# Altium schematic sheet DartBoard.SchDoc
size A1
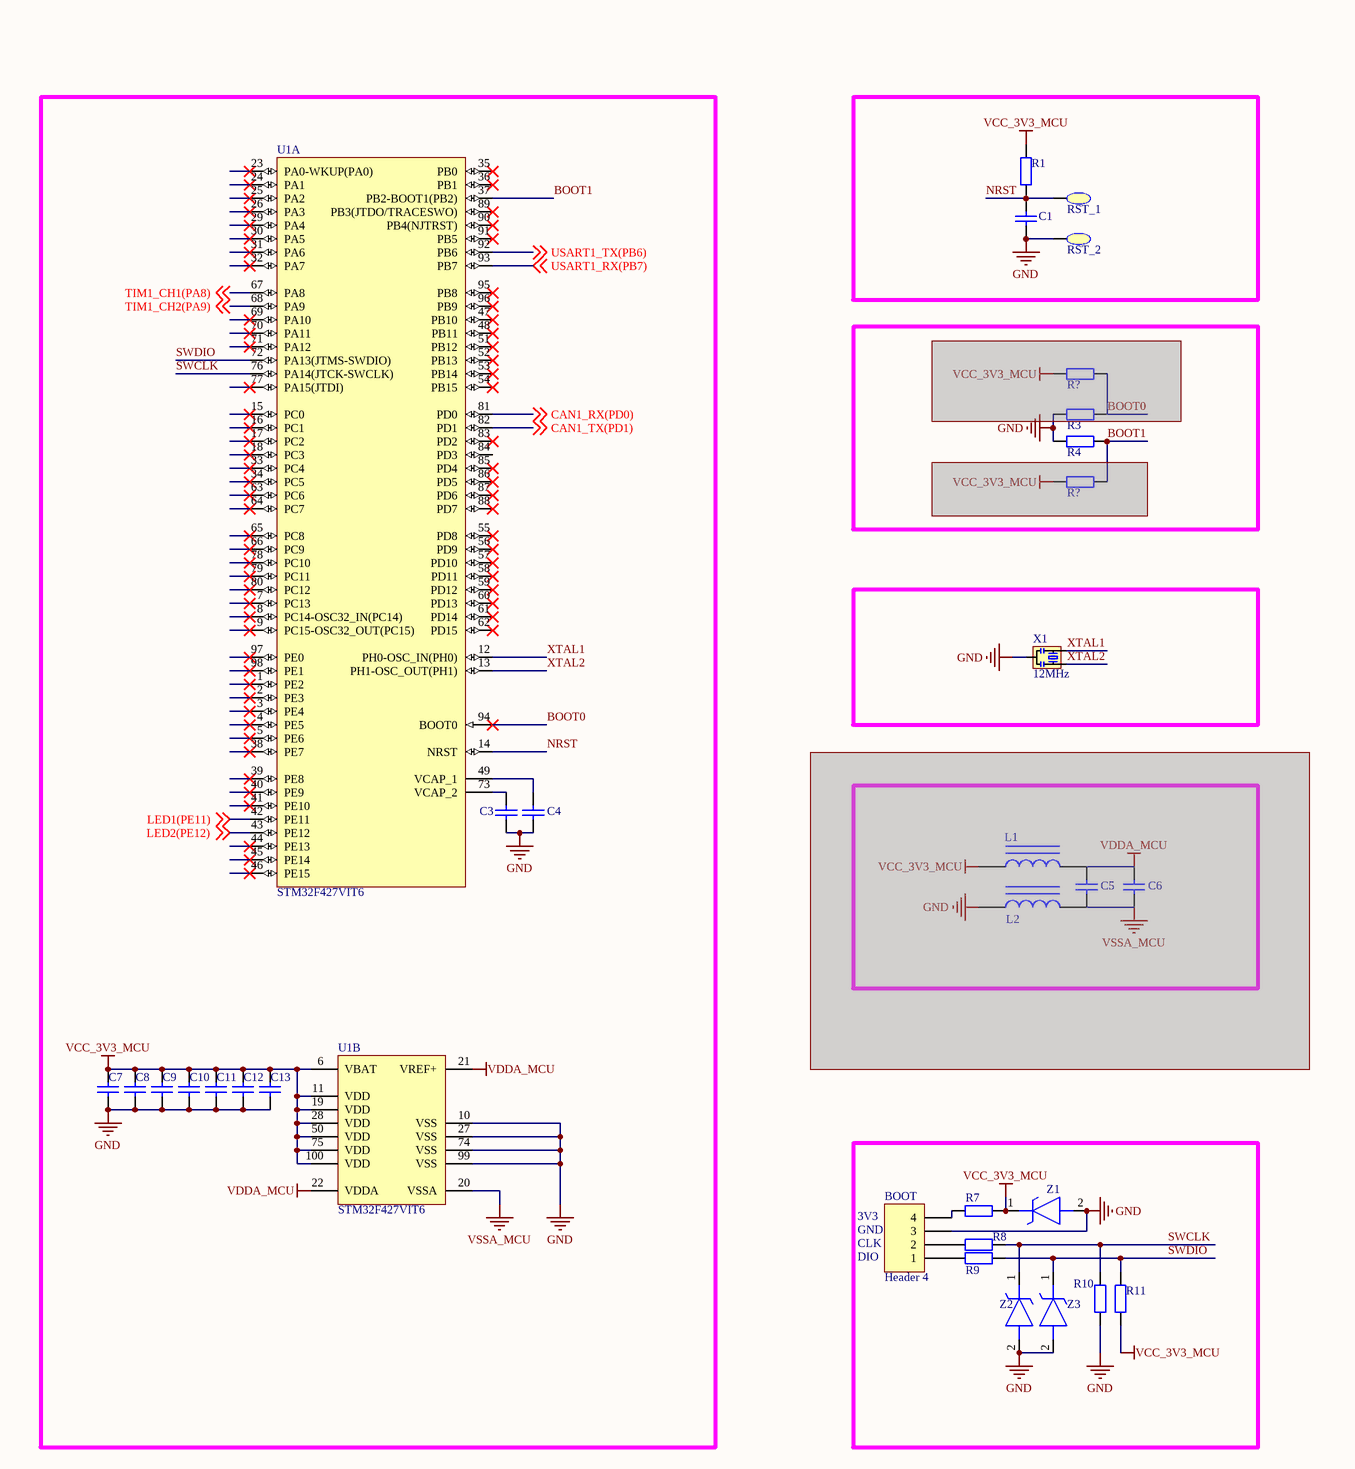
[diagram p0: DartBoard.SchDoc, top left]
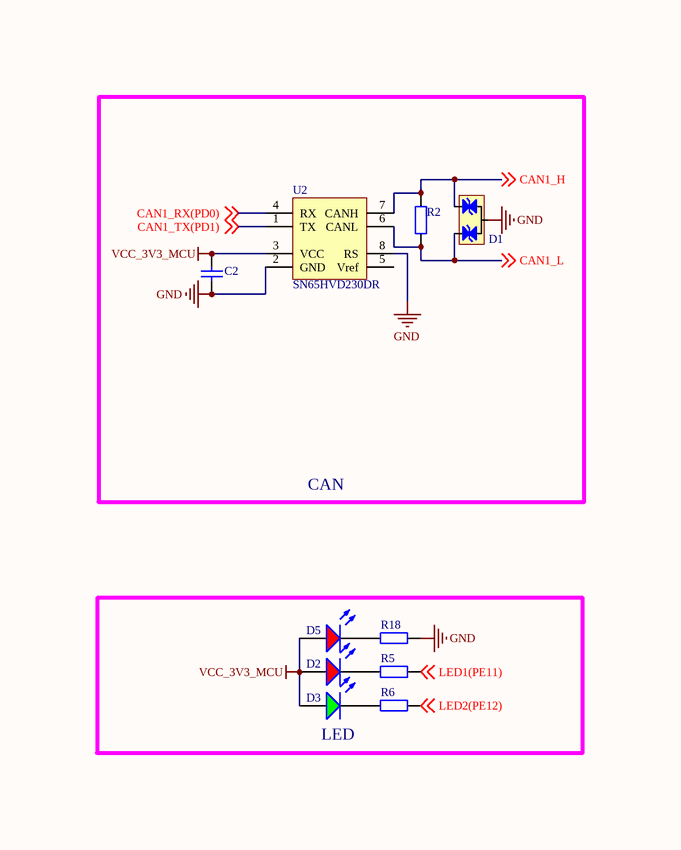
[diagram p1: DartBoard.SchDoc, top middle]
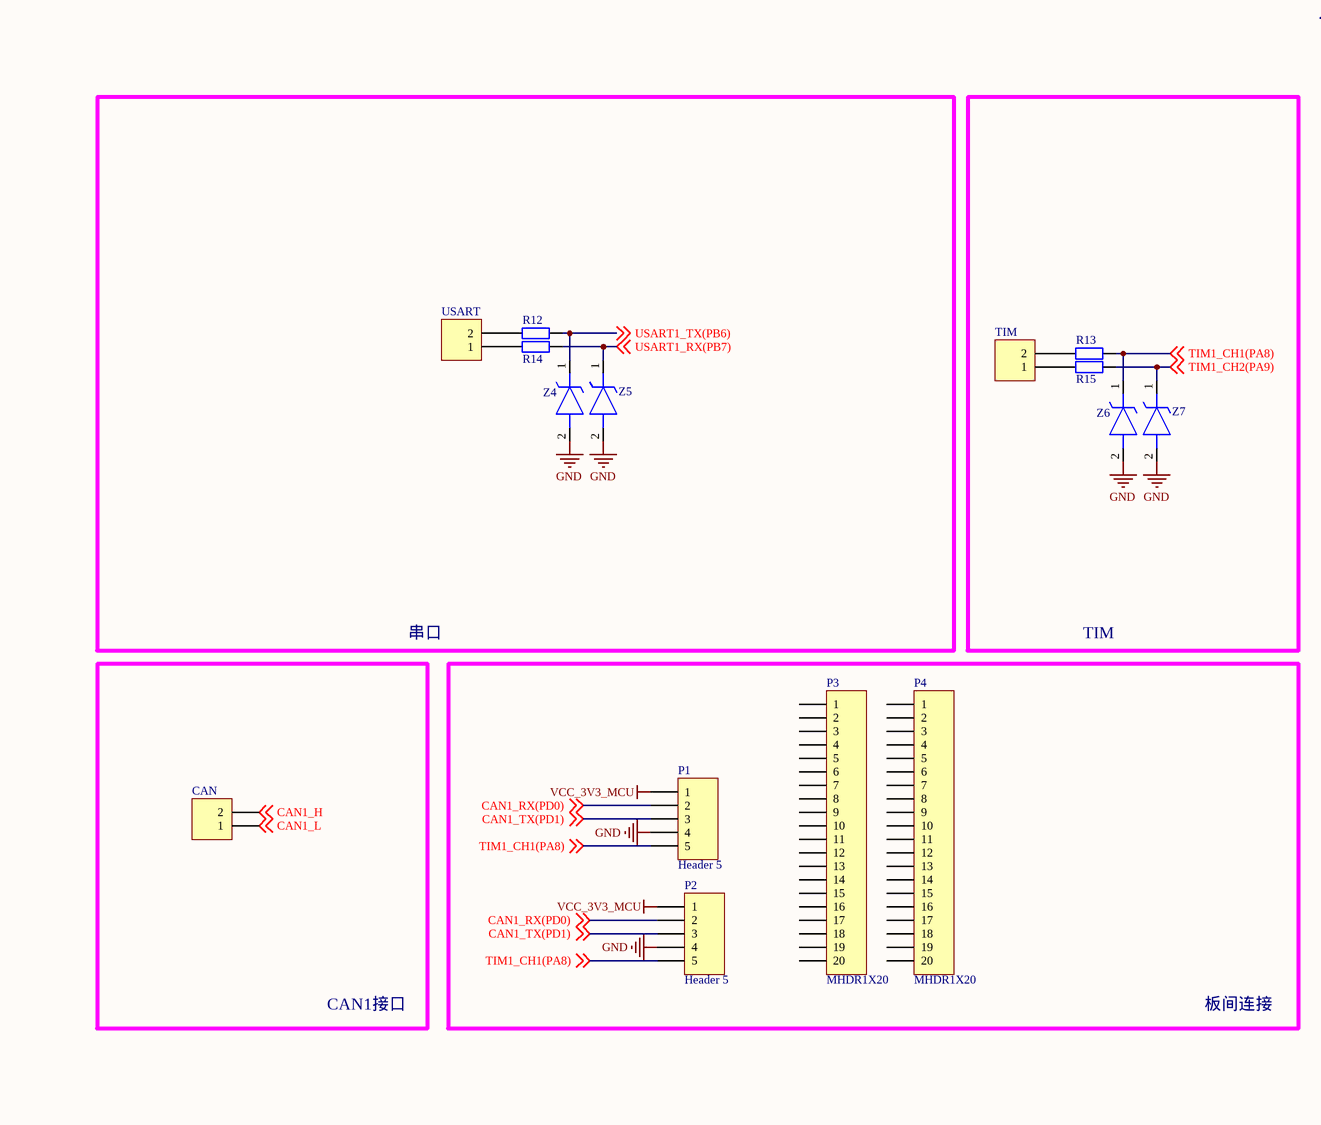
[diagram p2: DartBoard.SchDoc, bottom left]
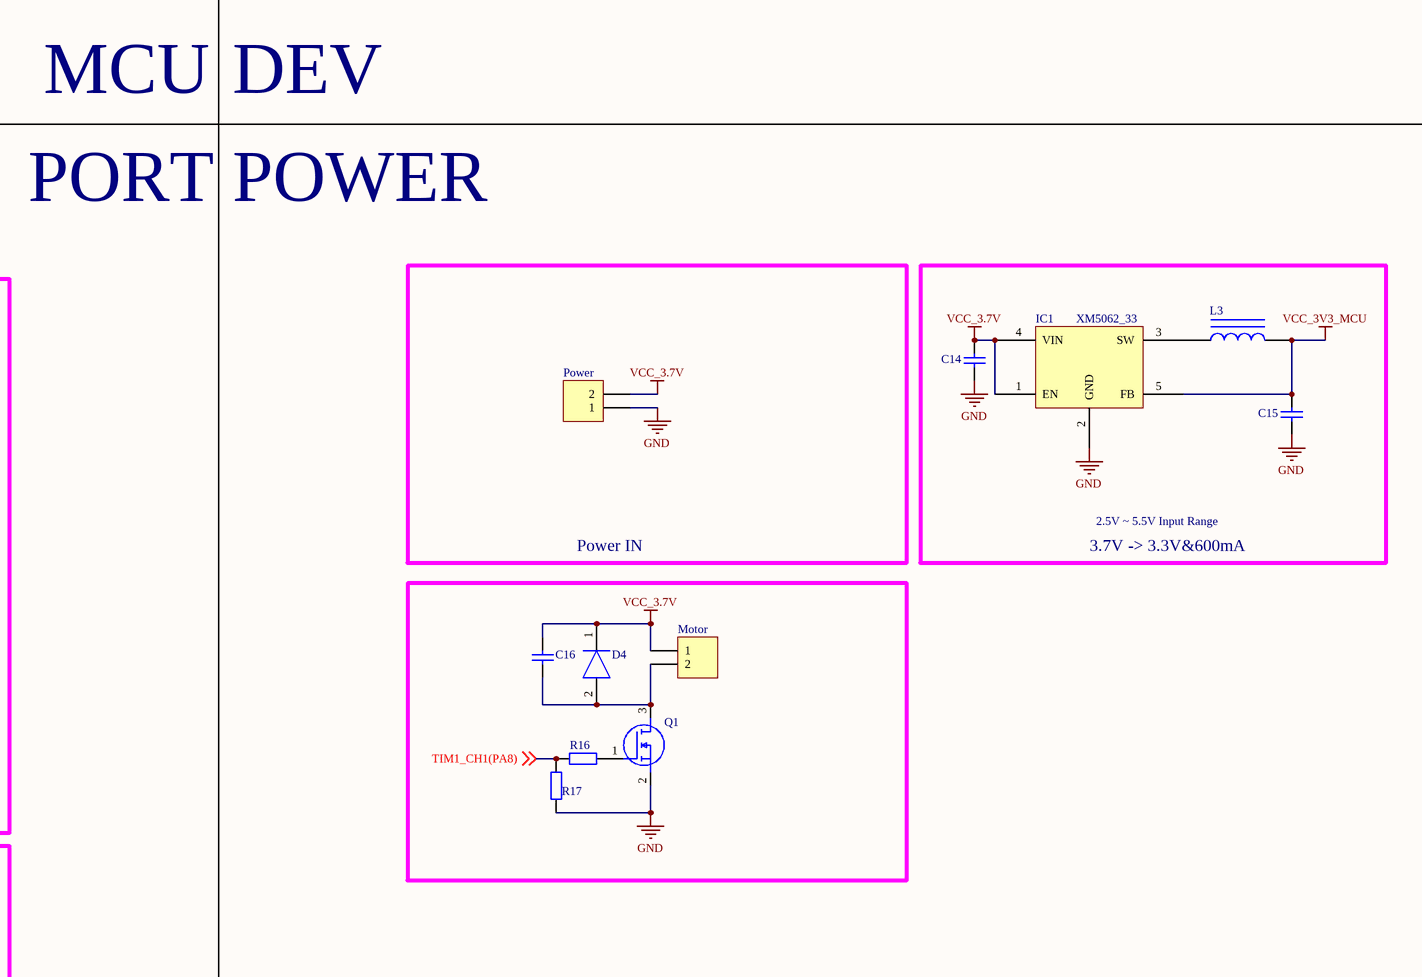
[diagram p3: DartBoard.SchDoc, bottom middle]

## Parts
(Parts that share a designator on the sheet are numbered #1, #2 ... from top to bottom, then left to right.)
BOOT  Header 4  [HDR1X4]
C1  100nF (104) 10% 50V  [0603_C]  (value not drawn)
C2  100nF (104) 10% 50V  [0603_C]  (value not drawn)
C3  2.2uF (225) 10% 16V  [0603_C]  (value not drawn)
C4  2.2uF (225) 10% 16V  [0603_C]  (value not drawn)
C5  1uF (105) 10% 50V  [0603_C]  (value not drawn)  (masked out: inside a compile mask, not in the netlist)
C6  100nF (104) 10% 50V  [0603_C]  (value not drawn)  (masked out: inside a compile mask, not in the netlist)
C7  100nF (104) 10% 50V  [0603_C]  (value not drawn)
C8  100nF (104) 10% 50V  [0603_C]  (value not drawn)
C9  100nF (104) 10% 50V  [0603_C]  (value not drawn)
C10  100nF (104) 10% 50V  [0603_C]  (value not drawn)
C11  100nF (104) 10% 50V  [0603_C]  (value not drawn)
C12  100nF (104) 10% 50V  [0603_C]  (value not drawn)
C13  100nF (104) 10% 50V  [0603_C]  (value not drawn)
C14  4.7uF (475) 10% 16V  [0603_C]  (value not drawn)
C15  10uF (106) 10% 10V  [0603_C]  (value not drawn)
C16  10uF (106) 10% 10V  [0603_C]  (value not drawn)
CAN  Header 2  [HDR1X2]  (value not drawn)
D1  PESD2CAN  [SOT-23-3]  (value not drawn)
D2  红灯 0603  [0603_LED_S1]  (value not drawn)
D3  绿灯 0603  [0603_LED_S1]  (value not drawn)
D4  SS14-E3_61T  [DIOM5127X229N]  (value not drawn)
D5  红灯 0603  [0603_LED_S1]  (value not drawn)
IC1  XM5062_33  [SOT-23-5]
L1  10uH ±10%  [0603_L]  (value not drawn)  (masked out: inside a compile mask, not in the netlist)
L2  10uH ±10%  [0603_L]  (value not drawn)  (masked out: inside a compile mask, not in the netlist)
L3  2.2uH ±10%  [0805_L]  (value not drawn)
Motor  Header 2  [HDR1X2]  (value not drawn)
P1  Header 5  [HDR1X5]
P2  Header 5  [HDR1X5]
P3  MHDR1X20  [MHDR1X20]
P4  MHDR1X20  [MHDR1X20]
Power  Header 2  [HDR1X2]  (value not drawn)
Q1  SI2302DS  [SOT95P230X110-3N]  (value not drawn)
R1  10KΩ (1002) ±1%  [0603_R]  (value not drawn)
R2  120Ω (1200) ±1%  [0603_R]  (value not drawn)
R3  10KΩ (1002) ±1%  [0603_R]  (value not drawn)  (masked out: inside a compile mask, not in the netlist)
R4  10KΩ (1002) ±1%  [0603_R]  (value not drawn)
R5  4.7KΩ (4701) ±1%  [0603_R]  (value not drawn)
R6  4.7KΩ (4701) ±1%  [0603_R]  (value not drawn)
R7  0Ω (0R0) ±1%  [0603_R]  (value not drawn)
R8  100Ω (1000) ±1%  [0603_R]  (value not drawn)
R9  100Ω (1000) ±1%  [0603_R]  (value not drawn)
R10  10KΩ (1002) ±1%  [0603_R]  (value not drawn)
R11  10KΩ (1002) ±1%  [0603_R]  (value not drawn)
R12  100Ω (1000) ±1%  [0603_R]  (value not drawn)
R13  100Ω (1000) ±1%  [0603_R]  (value not drawn)
R14  100Ω (1000) ±1%  [0603_R]  (value not drawn)
R15  100Ω (1000) ±1%  [0603_R]  (value not drawn)
R16  22Ω (22R0) ±1%  [0603_R]  (value not drawn)
R17  10KΩ (1002) ±1%  [0603_R]  (value not drawn)
R18  4.7KΩ (4701) ±1%  [0603_R]  (value not drawn)
R?#1  NC  [0603_R]  (value not drawn)  (masked out: inside a compile mask, not in the netlist)
R?#2  NC  [0603_R]  (value not drawn)  (masked out: inside a compile mask, not in the netlist)
RST_1  TestPoint  [TestPoint]  (value not drawn)
RST_2  TestPoint  [TestPoint]  (value not drawn)
TIM  Header 2  [HDR1X2]  (value not drawn)
U1  STM32F427VIT6  [STM-LQFP100_N]  (parts A,B of 2)
U2  SN65HVD230DR  [SOIC_8]
USART  Header 2  [HDR1X2]  (value not drawn)
X1  12MHz  [CSTCE_G(A)村田晶振]
Z1  BZT52C3V9S-7-F  [SOD2513X110N]  (value not drawn)
Z2  BZT52C3V9S-7-F  [SOD2513X110N]  (value not drawn)
Z3  BZT52C3V9S-7-F  [SOD2513X110N]  (value not drawn)
Z4  BZT52C3V9S-7-F  [SOD2513X110N]  (value not drawn)
Z5  BZT52C3V9S-7-F  [SOD2513X110N]  (value not drawn)
Z6  BZT52C3V9S-7-F  [SOD2513X110N]  (value not drawn)
Z7  BZT52C3V9S-7-F  [SOD2513X110N]  (value not drawn)

## Blocks framed on the sheet
CAN: C2 D1 R2 U2
LED: D2 D3 D5 R5 R6 R18
串口: R12 R14 USART Z4 Z5
TIM: R13 R15 TIM Z6 Z7
Power IN: Power
3.7V -> 3.3V&600mA: C14 C15 IC1 L3
CAN1接口: CAN
板间连接: P1-P4

## Nets
GND: BOOT.3 C1.1 C2.1 C3.1 C4.1 C7.1 C8.1 C9.1 C10.1 C11.1 C12.1 C13.1 C14.1 C15.1 D1.3 IC1.2(GND) P1.4 P2.4 Power.1 Q1.2(S) R4.2 R10.1 R17.1 R18.2 RST_2.1 U1.10(VSS) U1.27(VSS) U1.74(VSS) U1.99(VSS) U2.2(GND) U2.8(RS) X1.2(GND) Z1.2(A) Z2.2(A) Z3.2(A) Z4.2(A) Z5.2(A) Z6.2(A) Z7.2(A)
VCC_3.7V: C14.2 C16.2 D4.1(K) IC1.1(EN) IC1.4(VIN) Motor.1 Power.2
VCC_3V3_MCU: C2.2 C7.2 C8.2 C9.2 C10.2 C11.2 C12.2 C13.2 C15.2 D2.A D3.A D5.A IC1.5(FB) L3.2 P1.1 P2.1 R1.2 R7.2 R11.1 U1.6(VBAT) U1.11(VDD) U1.19(VDD) U1.28(VDD) U1.50(VDD) U1.75(VDD) U1.100(VDD) U2.3(VCC) Z1.1(K)
VDDA_MCU: U1.21(VREF+) U1.22(VDDA)
VSSA_MCU: U1.20(VSSA)
BOOT0: U1.94(BOOT0)
BOOT1: R4.1 U1.37(PB2-BOOT1(PB2))
CAN1_H: CAN.2 D1.2 R2.2 U2.7(CANH) ; off-sheet CAN1_H
CAN1_L: CAN.1 D1.1 R2.1 U2.6(CANL) ; off-sheet CAN1_L
CAN1_RX(PD0): P1.2 P2.2 U1.81(PD0) U2.4(RX) ; off-sheet CAN1_RX(PD0)
CAN1_TX(PD1): P1.3 P2.3 U1.82(PD1) U2.1(TX) ; off-sheet CAN1_TX(PD1)
LED1(PE11): R5.2 U1.42(PE11) ; off-sheet LED1(PE11)
LED2(PE12): R6.2 U1.43(PE12) ; off-sheet LED2(PE12)
NRST: C1.2 R1.1 RST_1.1 U1.14(NRST)
SWCLK: R8.2 R10.2 U1.76(PA14(JTCK-SWCLK)) Z2.1(K)
SWDIO: R9.2 R11.2 U1.72(PA13(JTMS-SWDIO)) Z3.1(K)
TIM1_CH1(PA8): P1.5 P2.5 R13.2 R16.1 R17.2 U1.67(PA8) Z6.1(K) ; off-sheet TIM1_CH1(PA8)
TIM1_CH2(PA9): R15.2 U1.68(PA9) Z7.1(K) ; off-sheet TIM1_CH2(PA9)
USART1_RX(PB7): R14.2 U1.93(PB7) Z5.1(K) ; off-sheet USART1_RX(PB7)
USART1_TX(PB6): R12.2 U1.92(PB6) Z4.1(K) ; off-sheet USART1_TX(PB6)
XTAL1: U1.12(PH0-OSC_IN(PH0)) X1.1(OSC1)
XTAL2: U1.13(PH1-OSC_OUT(PH1)) X1.3(OSC2)
NetBOOT_1: BOOT.1 R9.1
NetBOOT_2: BOOT.2 R8.1
NetBOOT_4: BOOT.4 R7.1
NetC3_2: C3.2 U1.73(VCAP_2)
NetC4_2: C4.2 U1.49(VCAP_1)
NetC16_1: C16.1 D4.2(A) Motor.2 Q1.3(D)
NetD2_K: D2.K R5.1
NetD3_K: D3.K R6.1
NetD5_K: D5.K R18.1
NetIC1_3: IC1.3(SW) L3.1
NetQ1_1: Q1.1(G) R16.2
NetR12_1: R12.1 USART.2
NetR13_1: R13.1 TIM.2
NetR14_1: R14.1 USART.1
NetR15_1: R15.1 TIM.1

Not connected (* = marked no-connect by the designer): P3 1 2 3 4 5 6 7 8 9 10 11 12 13 14 15 16 17 18 19 20; P4 1 2 3 4 5 6 7 8 9 10 11 12 13 14 15 16 17 18 19 20; U1 1(PE2)* 2(PE3)* 3(PE4)* 4(PE5)* 5(PE6)* 7(PC13)* 8(PC14-OSC32_IN(PC14))* 9(PC15-OSC32_OUT(PC15))* 15(PC0)* 16(PC1)* 17(PC2)* 18(PC3)* 23(PA0-WKUP(PA0))* 24(PA1)* 25(PA2)* 26(PA3)* 29(PA4)* 30(PA5)* 31(PA6)* 32(PA7)* 33(PC4)* 34(PC5)* 35(PB0)* 36(PB1)* 38(PE7)* 39(PE8)* 40(PE9)* 41(PE10)* 44(PE13)* 45(PE14)* 46(PE15)* 47(PB10)* 48(PB11)* 51(PB12)* 52(PB13)* 53(PB14)* 54(PB15)* 55(PD8)* 56(PD9)* 57(PD10)* 58(PD11)* 59(PD12)* 60(PD13)* 61(PD14)* 62(PD15)* 63(PC6)* 64(PC7)* 65(PC8)* 66(PC9)* 69(PA10)* 70(PA11)* 71(PA12)* 77(PA15(JTDI))* 78(PC10)* 79(PC11)* 80(PC12)* 83(PD2)* 84(PD3) 85(PD4)* 86(PD5)* 87(PD6)* 88(PD7)* 89(PB3(JTDO/TRACESWO))* 90(PB4(NJTRST))* 91(PB5)* 95(PB8)* 96(PB9)* 97(PE0)* 98(PE1)*; U2 5(Vref)

## Notes on the sheet
- (near BOOT) 3V3
- (near BOOT) GND
- (near BOOT) CLK
- (near BOOT) DIO
- MCU
- DEV
- PORT
- POWER
- 2.5V ~ 5.5V Input Range

## Library data of the parts
BOOT = Header 4: Header, 4-Pin; LatestRevisionDate: 17-Jul-2002; LatestRevisionNote: Re-released for DXP Platform.; Publisher: Altium Limited
C1 C2 C6-C13 = 0603 100nF (104) 10% 50V: 贴片电容; ComponentLink1Description: 供应商链接; ComponentLink1URL: http://www.szlcsc.com/product/details_15331.html; Package: 0603; Supplier: LC; SuppliersPartNumber: C14663
C3 C4 = 0603 2.2uF (225) 10% 16V: 贴片电容; ComponentLink1Description: 供应商链接; ComponentLink1URL: http://www.szlcsc.com/product/details_24366.html; Package: 0603; Supplier: LC; SuppliersPartNumber: C23630
C5 = 0603 1uF (105) 10% 50V: 贴片电容; ComponentLink1Description: 供应商链接; ComponentLink1URL: http://www.szlcsc.com/product/details_16531.html; Package: 0603; Supplier: LC; SuppliersPartNumber: C15849
C14 = 0603 4.7uF (475) 10% 16V: 贴片电容; ComponentLink1Description: 供应商链接; ComponentLink1URL: http://www.szlcsc.com/product/details_20375.html; Package: 0603; Supplier: LC; SuppliersPartNumber: C19666
C15 C16 = 0603 10uF (106) 10% 10V: 贴片电容; ComponentLink1Description: 供应商链接; ComponentLink1URL: http://www.szlcsc.com/product/details_20411.html; Package: 0603; Supplier: LC; SuppliersPartNumber: C19702
CAN Motor Power TIM USART = Header 2: Header, 2-Pin; LatestRevisionDate: 17-Jul-2002; LatestRevisionNote: Re-released for DXP Platform.; Publisher: Altium Limited
D1 = TVS_C2
D2 D5 = 0603 红灯: 发光二极管; ComponentLink1Description: 供应商链接; ComponentLink1URL: http://www.szlcsc.com/product/details_2659.html; Package: 0603; Supplier: LC; SuppliersPartNumber: C2286
D3 = 0603 绿灯: 发光二极管; ComponentLink1Description: 供应商链接; ComponentLink1URL: http://www.szlcsc.com/product/details_73152.html; Package: 0603; Supplier: LC; SuppliersPartNumber: C72043
D4 = SS14-E3_61T: Diode; Manufacturer_Name: Vishay; Manufacturer_Part_Number: SS14-E3/61T; Allied_Number: 70217666; Datasheet Link: http://docs-emea.rs-online.com/webdocs/0928/0900766b809284de.pdf; Height: 2.29mm; Mouser Part Number: 625-SS14-E3; Mouser Price/Stock: https://www.mouser.com/Search/Refine.aspx?Keyword=625-SS14-E3; RS Part Number: 6387915P; RS Price/Stock: http://uk.rs-online.com/web/p/products/6387915P; Allied Price/Stock: https://www.alliedelec.com/general-semiconductor-vishay-ss14-e3-61t/70217666/
IC1 = 1-1393258-5: Relay or Contactor; Manufacturer_Name: TE Connectivity; Datasheet Link: http://www.te.com/commerce/DocumentDelivery/DDEController?Action=showdoc&DocId=Data+Sheet%7FSR2M%7F1116%7Fpdf%7FEnglish%7FENG_DS_SR2M_1116.pdf%7F1-1393258-5; Height: 25mm; Manufacturer_Part_Number: 1-1393258-5
L1 L2 = 0603 10uH 10%: 贴片电感; ComponentLink1Description: 供应商链接; ComponentLink1URL: http://www.szlcsc.com/product/details_1387.html; Package: 0603; Supplier: LC; SuppliersPartNumber: C1035
L3 = 0805 2.2uH 10%: 贴片电感; ComponentLink1Description: 供应商链接; ComponentLink1URL: http://www.szlcsc.com/product/details_1395.html; Package: 0805; Supplier: LC; SuppliersPartNumber: C1043
P1 P2 = Header 5: Header, 5-Pin; LatestRevisionDate: 17-Jul-2002; LatestRevisionNote: Re-released for DXP Platform.; Publisher: Altium Limited
P3 P4 = MHDR1X20: Header, 20-Pin; LatestRevisionDate: 17-Jul-2002; LatestRevisionNote: Re-released for DXP Platform.; Publisher: Altium Limited
Q1 = SI2302DS: MOSFET (N-Channel); Manufacturer_Name: Nexperia; Datasheet Link: https://assets.nexperia.com/documents/data-sheet/SI2302DS.pdf; Height: 1.1mm; Manufacturer_Part_Number: SI2302DS; Mouser Part Number: N/A; Mouser Price/Stock: https://www.mouser.com/Search/Refine.aspx?Keyword=N%2FA; RS Part Number: 7983053P; RS Price/Stock: http://uk.rs-online.com/web/p/products/7983053P
R1 R3 R4 R10 R11 R17 R?#1 R?#2 = 0603 10KΩ (1002) 1%: 贴片电阻; ComponentLink1Description: 供应商链接; ComponentLink1URL: http://www.szlcsc.com/product/details_26547.html; Package: 0603; Supplier: LC; SuppliersPartNumber: C25804
R2 = 0603 120Ω (1200) 1%: 贴片电阻; ComponentLink1Description: 供应商链接; ComponentLink1URL: http://www.szlcsc.com/product/details_23514.html; Package: 0603; Supplier: LC; SuppliersPartNumber: C22787
R5 R6 R18 = 0603 4.7KΩ (4701) 1%: 贴片电阻; ComponentLink1Description: 供应商链接; ComponentLink1URL: http://www.szlcsc.com/product/details_23889.html; Package: 0603; Supplier: LC; SuppliersPartNumber: C23162
R7 = 0603 0Ω (0R0) 1%: 贴片电阻; ComponentLink1Description: 供应商链接; ComponentLink1URL: http://www.szlcsc.com/product/details_21903.html; Package: 0603; Supplier: LC; SuppliersPartNumber: C21189
R8 R9 R12-R15 = 0603 100Ω (1000) 1%: 贴片电阻; ComponentLink1Description: 供应商链接; ComponentLink1URL: http://www.szlcsc.com/product/details_23502.html; Package: 0603; Supplier: LC; SuppliersPartNumber: C22775
R16 = 0603 22Ω (22R0) 1%: 贴片电阻; ComponentLink1Description: 供应商链接; ComponentLink1URL: http://www.szlcsc.com/product/details_24078.html; Package: 0603; Supplier: LC; SuppliersPartNumber: C23345
U1 = STM32F427VIT6: ARM Cortex-M4 32-bit MCU+FPU, 210 DMIPS, 2048 kB Flash, 256 kB Internal RAM, 82 I/Os, 100-pin LQFP, -40 to 85 degC, Tray; Manufacturer: STMicroelectronics; D/A Converter: 2x12-bit; FLASH Size (Prog) (kB): 2048; I/Os (High Current): 82; Internal RAM Size (kB): 256; Operating Frequency(F) (Processor speed) (MHz): 168; Supply Voltage(Vcc) max (V): 3.6; Supply Voltage(Vcc) min (V): 1.8; DatasheetVersion: Rev. 1; PackageVersion: Rev. 1, 06/2013; PackageReference: LQFP100; PackageDescription: 100-Pin Low Profile Quad Flat Package, 14 x 14 mm Body, 0.5 mm Pitch; Supplier 1: Digi-Key; Supplier Part Number 1: 497-14049-ND; Supplier 2: Farnell; Supplier Part Number 2: 2333369; Supplier 3: Newark; Supplier Part Number 3: 99W9927; Supplier 4: Newark; Supplier Part Number 4: 66W7312; Supplier 5: Mouser; Supplier Part Number 5: 511-STM32F427VIT6; Core: ARM Cortex-M4; Packing: Tray; Mounting Technology: Surface Mount; PartNumber: STM32F427VIT6; ComponentLink1Description: Manufacturer URL; ComponentLink1URL: http://www.st.com/web/en/home.html; ComponentLink2Description: Datasheet; ComponentLink2URL: http://www.st.com/st-web-ui/static/active/en/resource/technical/document/datasheet/DM00071990.pdf; ComponentLink3Description: Package Specification; ComponentLink3URL: http://www.st.com/st-web-ui/static/active/en/resource/technical/document/data_brief/DM00071938.pdf
U2 = SN65HVD230DR: CAN芯片
X1 = XTAL-3215
Z1-Z7 = BZT52C3V9S-7-F: Zener Diode; Manufacturer_Name: Diodes Inc.; Allied_Number: 70437795; Datasheet Link: https://www.diodes.com/assets/Datasheets/ds30093.pdf; Height: 1.1mm; Manufacturer_Part_Number: BZT52C3V9S-7-F; Mouser Part Number: 621-BZT52C3V9S-F; Mouser Price/Stock: https://www.mouser.com/Search/Refine.aspx?Keyword=621-BZT52C3V9S-F; RS Part Number: 7513761; RS Price/Stock: https://uk.rs-online.com/web/p/products/7513761; Allied Price/Stock: https://www.alliedelec.com/diodes-inc-bzt52c3v9s-7-f/70437795/